# EAGLE design OmniRotor_PogoPlate (EAGLE 5.10)
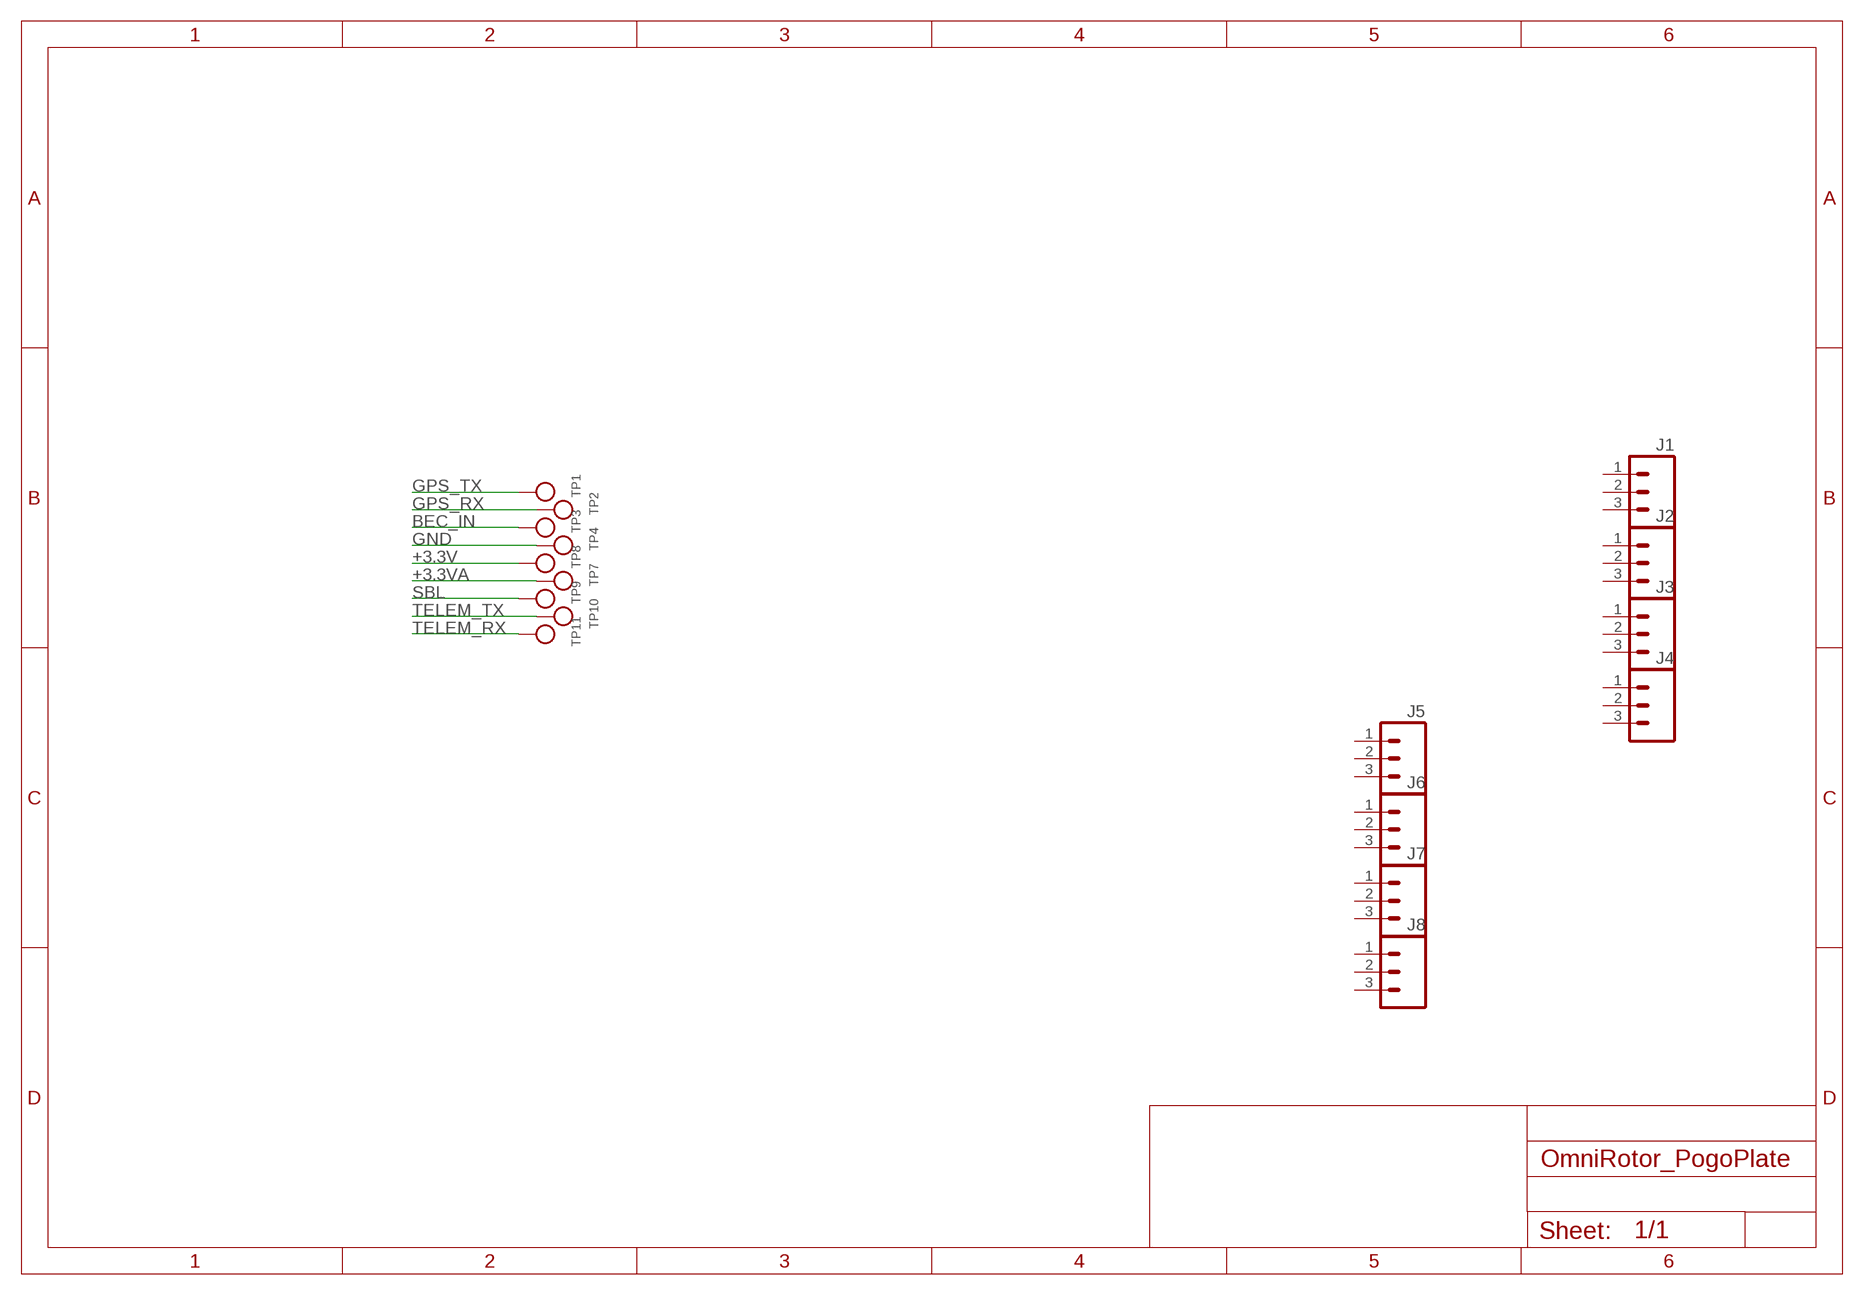
[diagram p0: schematic, sheet 1]

## Parts
J1  M03  [1X03]
J2  M03  [1X03]
J3  M03  [1X03]
J4  M03  [1X03]
J5  M03  [1X03]
J6  M03  [1X03]
J7  M03  [1X03]
J8  M03  [1X03]
TP1  TESTPOINTPOGOPIN1MM  [TESTPOINT_1MM_POGOPIN]
TP2  TESTPOINTPOGOPIN1MM  [TESTPOINT_1MM_POGOPIN]
TP3  TESTPOINTPOGOPIN1MM  [TESTPOINT_1MM_POGOPIN]
TP4  TESTPOINTPOGOPIN1MM  [TESTPOINT_1MM_POGOPIN]
TP7  TESTPOINTPOGOPIN1MM  [TESTPOINT_1MM_POGOPIN]
TP8  TESTPOINTPOGOPIN1MM  [TESTPOINT_1MM_POGOPIN]
TP9  TESTPOINTPOGOPIN1MM  [TESTPOINT_1MM_POGOPIN]
TP10  TESTPOINTPOGOPIN1MM  [TESTPOINT_1MM_POGOPIN]
TP11  TESTPOINTPOGOPIN1MM  [TESTPOINT_1MM_POGOPIN]

## Nets
+3.3V: TP8.1
+3.3VA: TP7.1
BEC_IN: TP3.1
GND: TP4.1
GPS_RX: TP2.1
GPS_TX: TP1.1
SBL: TP9.1
TELEM_RX: TP11.1
TELEM_TX: TP10.1
Unconnected: J1.1 J1.2 J1.3 J2.1 J2.2 J2.3 J3.1 J3.2 J3.3 J4.1 J4.2 J4.3 J5.1 J5.2 J5.3 J6.1 J6.2 J6.3 J7.1 J7.2 J7.3 J8.1 J8.2 J8.3

## Library data of the parts
J1-J8 = OmniLoco:M03
TP1-TP4 TP7-TP11 = OmniLoco:TESTPOINT: Testpoint Footprints for testpoints, commonly used for debugging or connection points for pogopins. POGOPIN1MM - Throughhole footprint for 1mm pogopins. ROUND1MM - Smallest testpoint, for use with pogopins. ROUND1.5MM - Larger testpoint, more suited to handheld probing.

## Board
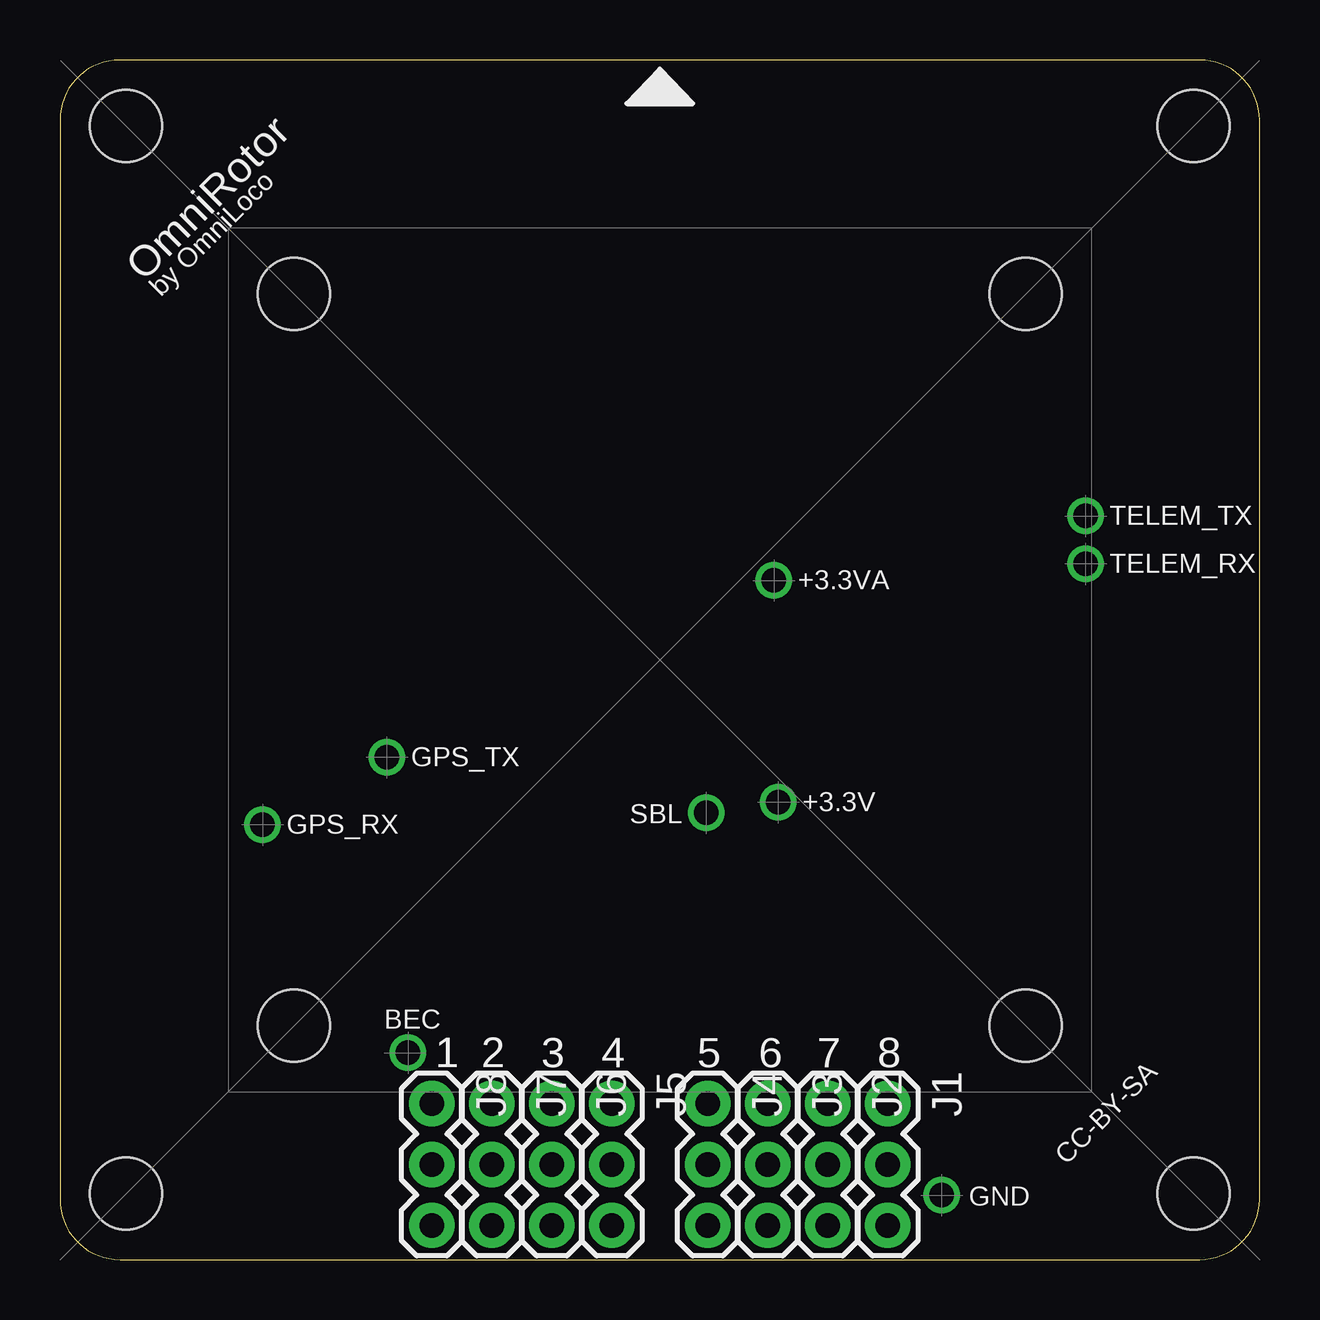
[diagram p1: board, top side]
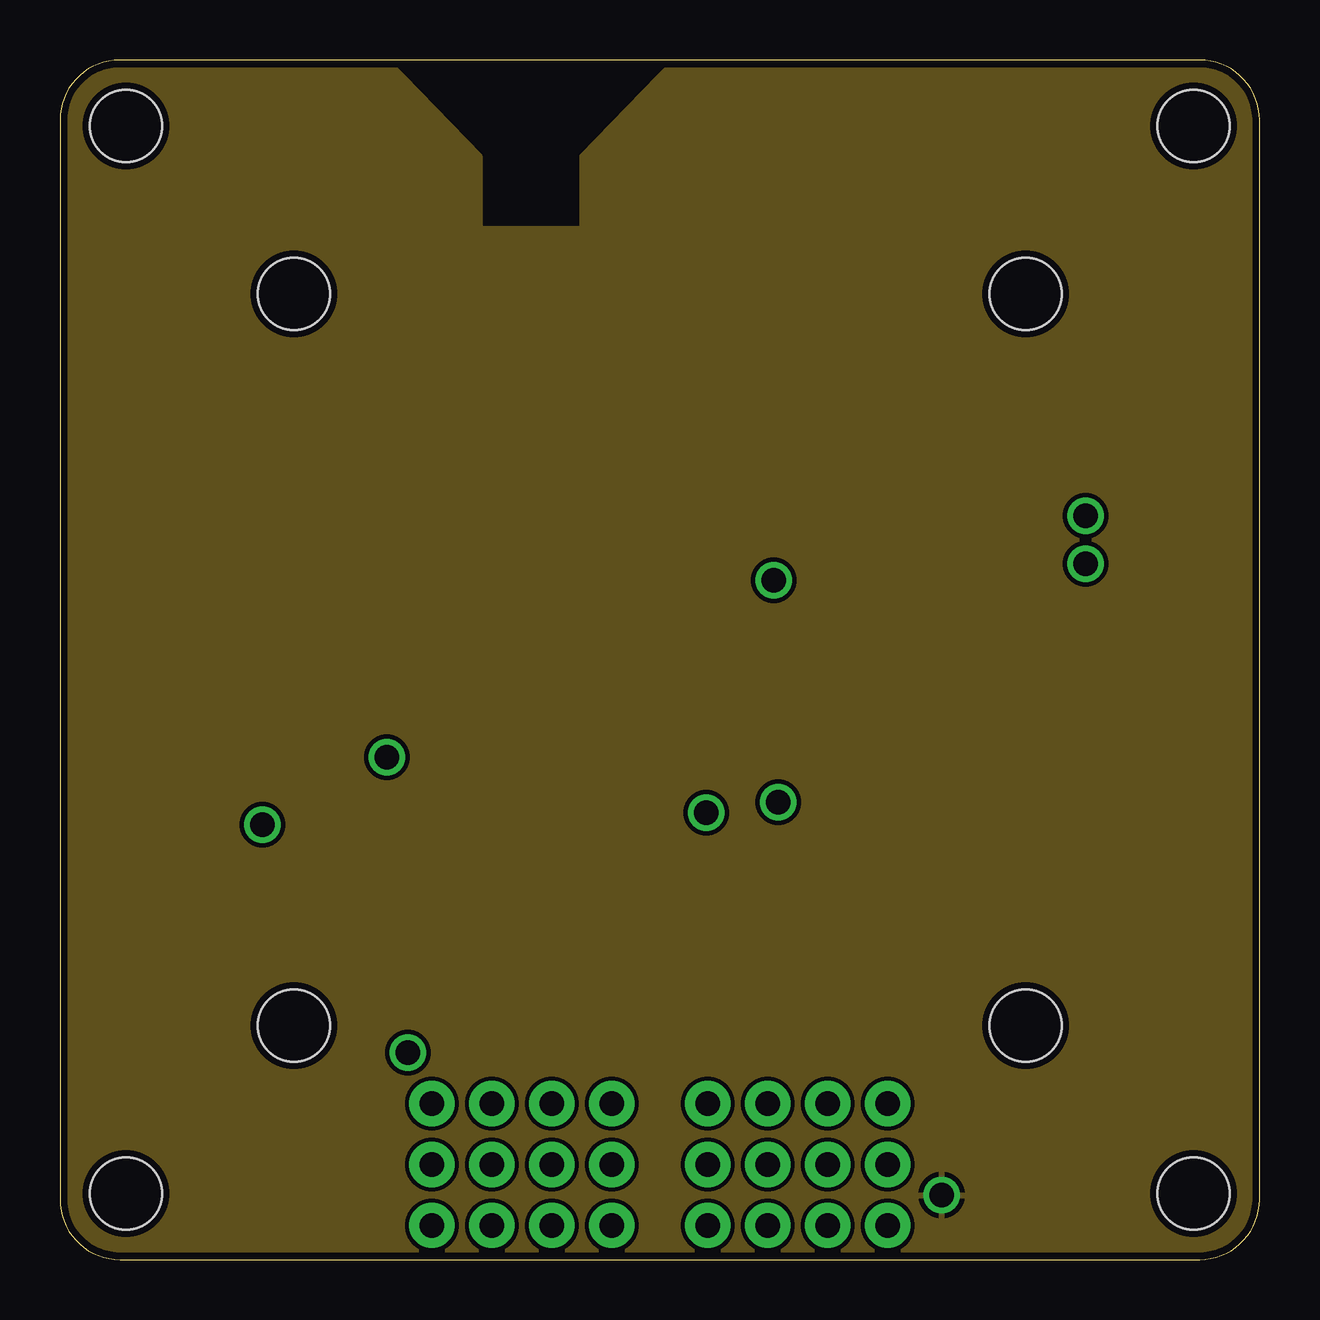
[diagram p2: board, inner layer Route2]
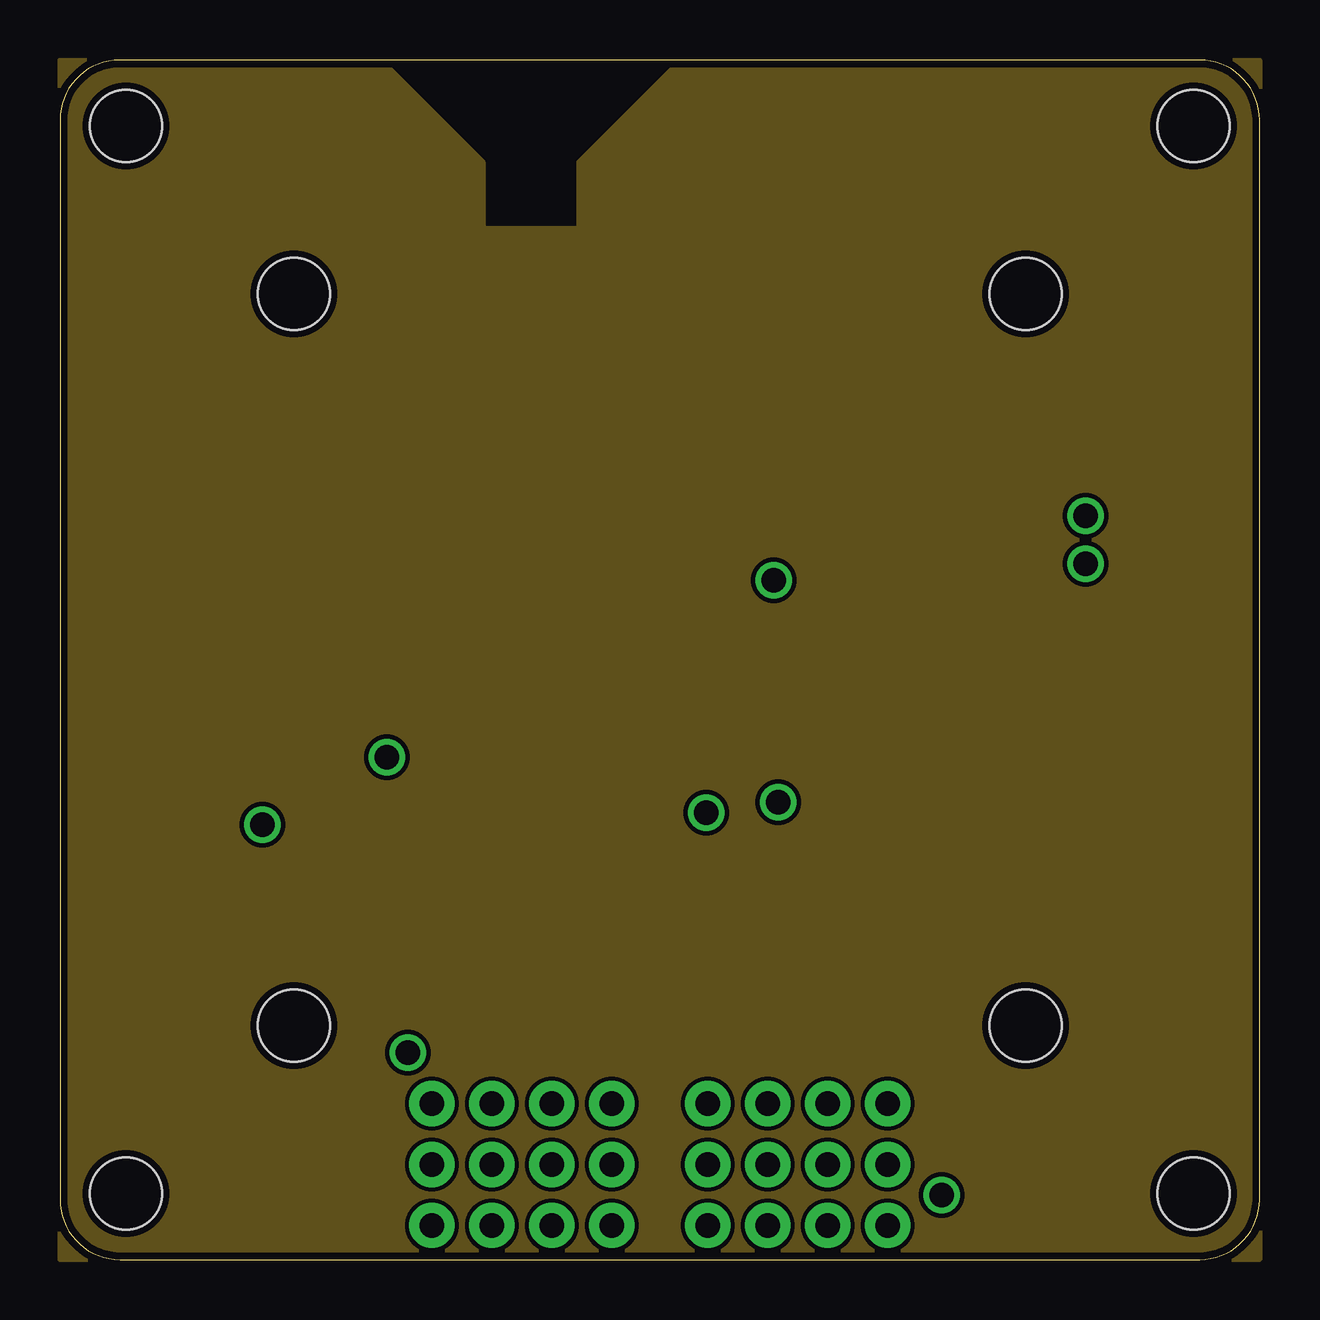
[diagram p3: board, inner layer Route15]
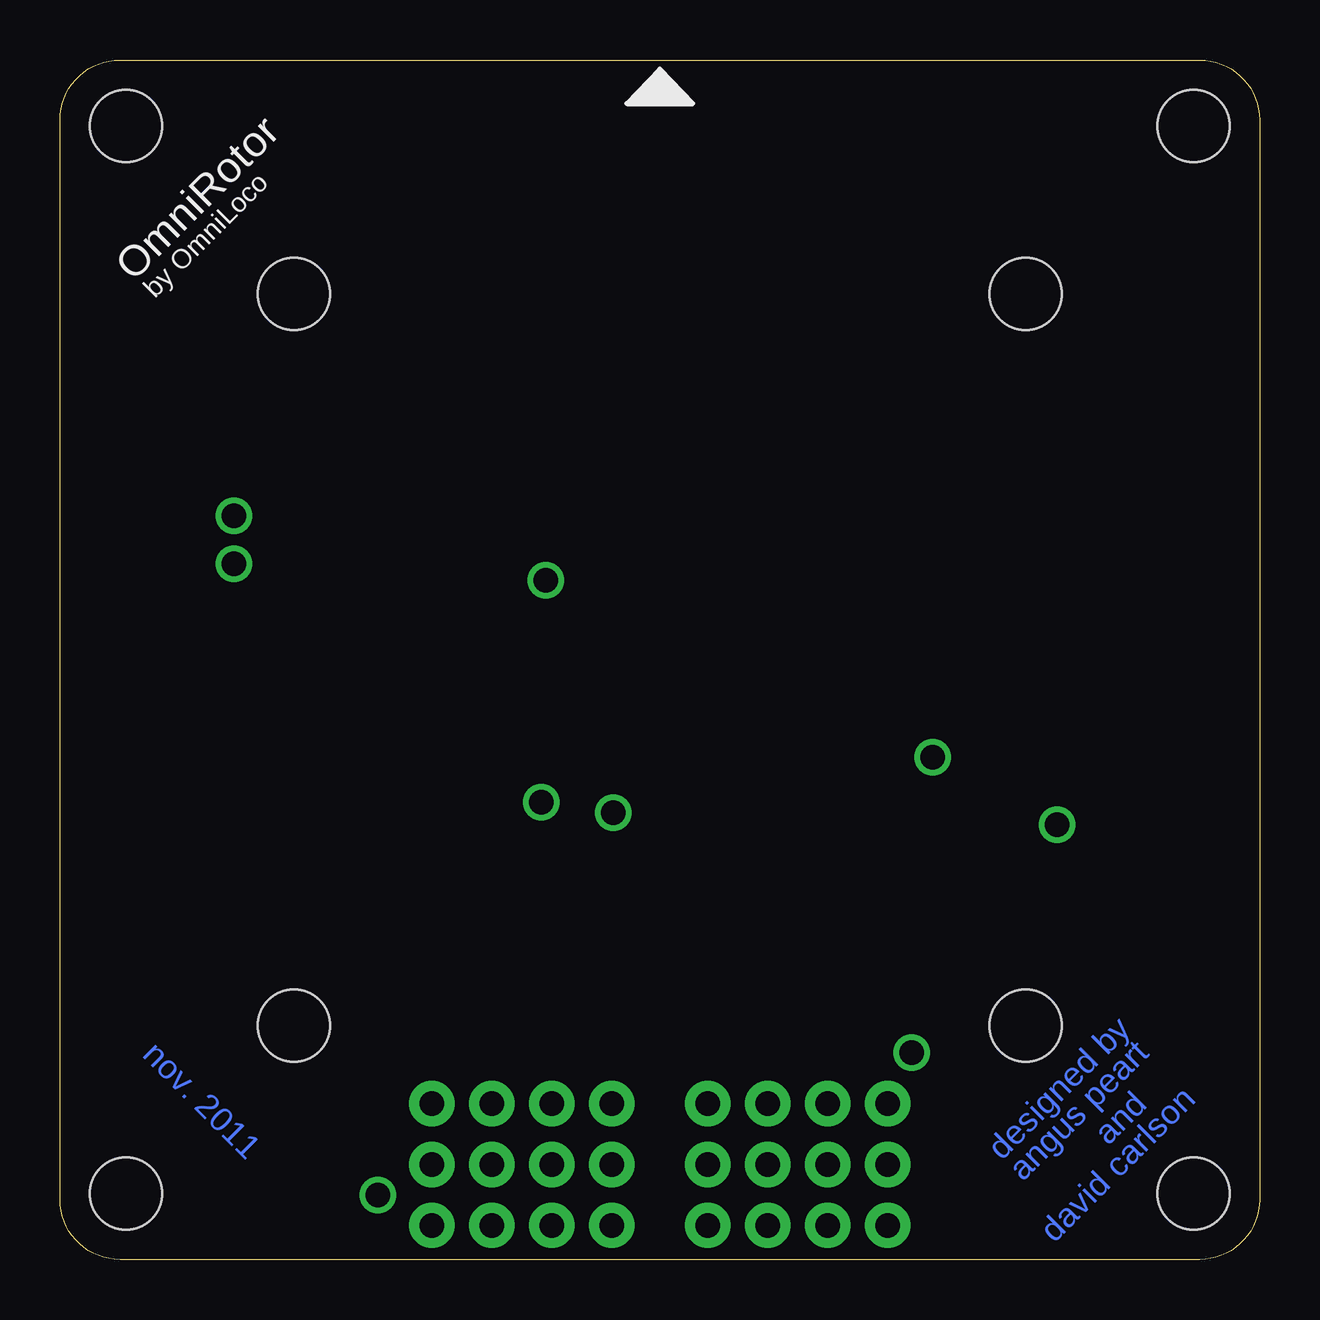
[diagram p4: board, bottom side, seen from below]

Size 50 x 50 mm. Coordinates in mm from the lower left corner, seen from the top.
Outline: 50,47.5 arc90 47.5,50 2.5,50 arc90 0,47.5 0,2.5 arc90 2.5,0 47.5,0 arc90 50,2.5 50,47.5
Copper layers (1*2+15*16): Top 0.0356mm / dielectric 1.5011mm / Route2 0.0356mm / dielectric 0.1499mm / Route15 0.0356mm / dielectric 0.2007mm / Bottom 0.0356mm
Design rules "PCBWing (4 Layer)": minimum track width 0.15mm, minimum drill 0.3mm, track to track 7mil, track to pad 7mil, pad to pad 7mil, via to via 7mil, smd to smd 7mil, copper to edge 0.3mm, drill to drill 0.3mm, minimum pad ring 10mil, minimum via ring 0.15mm, stop-mask expansion 4mil, vias tented up to drill 25mil, thermal gap 8mil
Holes 3 mm at 9.75,40.25 40.25,40.25 40.25,9.75 9.75,9.75 2.75,47.25 47.25,47.25 47.25,2.75 2.75,2.75
tKeepout: area 0.2,0.2 to 5.2,5.2; area 7.2,7.2 to 12.2,12.2; area 0.2,44.8 to 5.2,49.8; area 7.2,37.8 to 12.2,42.8; area 37.8,37.8 to 42.8,42.8; area 37.8,7.2 to 42.8,12.2; area 44.8,0.2 to 49.8,5.2; area 44.8,44.8 to 49.8,49.8

### Footprints (pad centres in the part's own frame; a part is rotated, then mirrored left to right if it is on the bottom)
1X03 = drill 1.016 pad 1.88 round: 1 0,0; 2 2.54,0; 3 5.08,0
TESTPOINT_1MM_POGOPIN = drill 1.016 round: 1 0,0

### Placement (x,y rotation side)
J1  34.5,6.5 270 top
J2  32,6.5 270 top
J3  29.5,6.5 270 top
J4  27,6.5 270 top
J5  23,6.5 270 top
J6  20.5,6.5 270 top
J7  18,6.5 270 top
J8  15.5,6.5 270 top
TP1  13.62,20.94 0 bottom
TP2  8.44,18.12 0 bottom
TP3  14.5,8.62 0 bottom
TP4  36.75,2.69 0 bottom
TP7  29.75,28.31 0 bottom
TP8  29.94,19.06 0 top
TP9  26.94,18.62 0 bottom
TP10  42.75,31 0 top
TP11  42.75,29 0 top

### Tracks (layer width: path | path; a pad name or v marks a point on that pad's centre or on a via)
3.3V
  pour Route15: 0,0 0,50 13.38,50 17.62,45.75 17.62,43 21.62,43 21.62,45.75 25.88,50 50,50 50,0
GND
  pour Route2: 0,0 0,50 13.62,50 17.5,46 17.5,43 21.75,43 21.75,46 25.62,50 50,50 50,0

### Text on the board
Bottom: nov. 2011 | and | designed by | angus peart | david carlson
_tsilk: OmniRotor | by OmniLoco | TELEM_TX | TELEM_RX | +3.3VA | GPS_TX | SBL | +3.3V | GPS_RX | BEC | 1 | 2 | 3 | 4 | 5 | 6 | 7 | 8 | CC-BY-SA | GND
_bsilk: OmniRotor | by OmniLoco